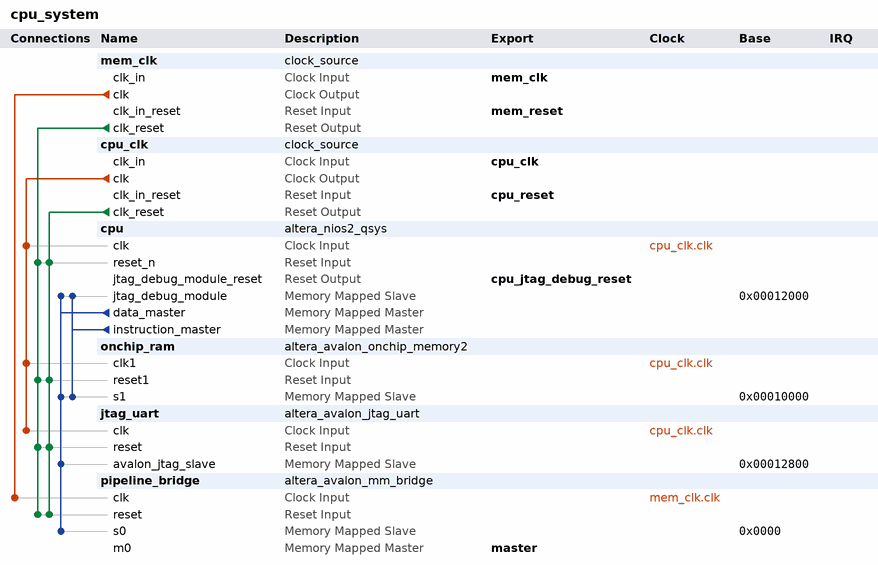
[diagram p0: system contents]
# Platform Designer (Qsys) system cpu_system
# Parameters at their usual value, and those the tool derives, are not listed.
package require -exact qsys 11.0
create_system cpu_system
set_project_property DEVICE_FAMILY CYCLONEIII

add_instance mem_clk clock_source 11.0
set_instance_parameter_value mem_clk clockFrequency 50000000
set_instance_parameter_value mem_clk clockFrequencyKnown false

add_instance cpu_clk clock_source 11.0
set_instance_parameter_value cpu_clk clockFrequency 50000000
set_instance_parameter_value cpu_clk clockFrequencyKnown false

add_instance cpu altera_nios2_qsys 11.0
set_instance_parameter_value cpu mmu_autoAssignTlbPtrSz false
set_instance_parameter_value cpu manuallyAssignCpuID false
set_instance_parameter_value cpu mmu_TLBMissExcOffset 32
set_instance_parameter_value cpu resetSlave onchip_ram.s1
set_instance_parameter_value cpu exceptionSlave onchip_ram.s1
set_instance_parameter_value cpu breakSlave cpu.jtag_debug_module
set_instance_parameter_value cpu impl Tiny
set_instance_parameter_value cpu icache_size 4096

add_instance onchip_ram altera_avalon_onchip_memory2 11.0
set_instance_parameter_value onchip_ram dataWidth 32
set_instance_parameter_value onchip_ram dualPort false
set_instance_parameter_value onchip_ram initMemContent true
set_instance_parameter_value onchip_ram initializationFileName onchip_ram
set_instance_parameter_value onchip_ram memorySize 8192

add_instance jtag_uart altera_avalon_jtag_uart 11.0
set_instance_parameter_value jtag_uart simInteractiveOptions INTERACTIVE_ASCII_OUTPUT

add_instance pipeline_bridge altera_avalon_mm_bridge 11.0
set_instance_parameter_value pipeline_bridge DATA_WIDTH 32
set_instance_parameter_value pipeline_bridge ADDRESS_WIDTH 16
set_instance_parameter_value pipeline_bridge ADDRESS_UNITS SYMBOLS
set_instance_parameter_value pipeline_bridge MAX_PENDING_RESPONSES 1

# connections
add_connection cpu_clk.clk cpu.clk clock
add_connection cpu_clk.clk jtag_uart.clk clock
add_connection cpu_clk.clk onchip_ram.clk1 clock
add_connection mem_clk.clk pipeline_bridge.clk clock
add_connection cpu_clk.clk_reset cpu.reset_n reset
add_connection cpu_clk.clk_reset jtag_uart.reset reset
add_connection cpu_clk.clk_reset onchip_ram.reset1 reset
add_connection cpu_clk.clk_reset pipeline_bridge.reset reset
add_connection mem_clk.clk_reset cpu.reset_n reset
add_connection mem_clk.clk_reset jtag_uart.reset reset
add_connection mem_clk.clk_reset onchip_ram.reset1 reset
add_connection mem_clk.clk_reset pipeline_bridge.reset reset
add_connection cpu.data_master cpu.jtag_debug_module avalon
set_connection_parameter_value cpu.data_master/cpu.jtag_debug_module baseAddress 0x00012000
add_connection cpu.data_master jtag_uart.avalon_jtag_slave avalon
set_connection_parameter_value cpu.data_master/jtag_uart.avalon_jtag_slave baseAddress 0x00012800
add_connection cpu.data_master onchip_ram.s1 avalon
set_connection_parameter_value cpu.data_master/onchip_ram.s1 baseAddress 0x00010000
add_connection cpu.data_master pipeline_bridge.s0 avalon
set_connection_parameter_value cpu.data_master/pipeline_bridge.s0 baseAddress 0x0000
add_connection cpu.instruction_master cpu.jtag_debug_module avalon
set_connection_parameter_value cpu.instruction_master/cpu.jtag_debug_module baseAddress 0x00012000
add_connection cpu.instruction_master onchip_ram.s1 avalon
set_connection_parameter_value cpu.instruction_master/onchip_ram.s1 baseAddress 0x00010000

# exported interfaces
add_interface mem_clk clock sink
set_interface_property mem_clk EXPORT_OF mem_clk.clk_in
add_interface mem_reset reset sink
set_interface_property mem_reset EXPORT_OF mem_clk.clk_in_reset
add_interface cpu_clk clock sink
set_interface_property cpu_clk EXPORT_OF cpu_clk.clk_in
add_interface cpu_reset reset sink
set_interface_property cpu_reset EXPORT_OF cpu_clk.clk_in_reset
add_interface master avalon master
set_interface_property master EXPORT_OF pipeline_bridge.m0
add_interface cpu_jtag_debug_reset reset source
set_interface_property cpu_jtag_debug_reset EXPORT_OF cpu.jtag_debug_module_reset

save_system cpu_system.qsys
